# EAGLE schematic Parking Lot System Main Board (EAGLE 9.6.2)
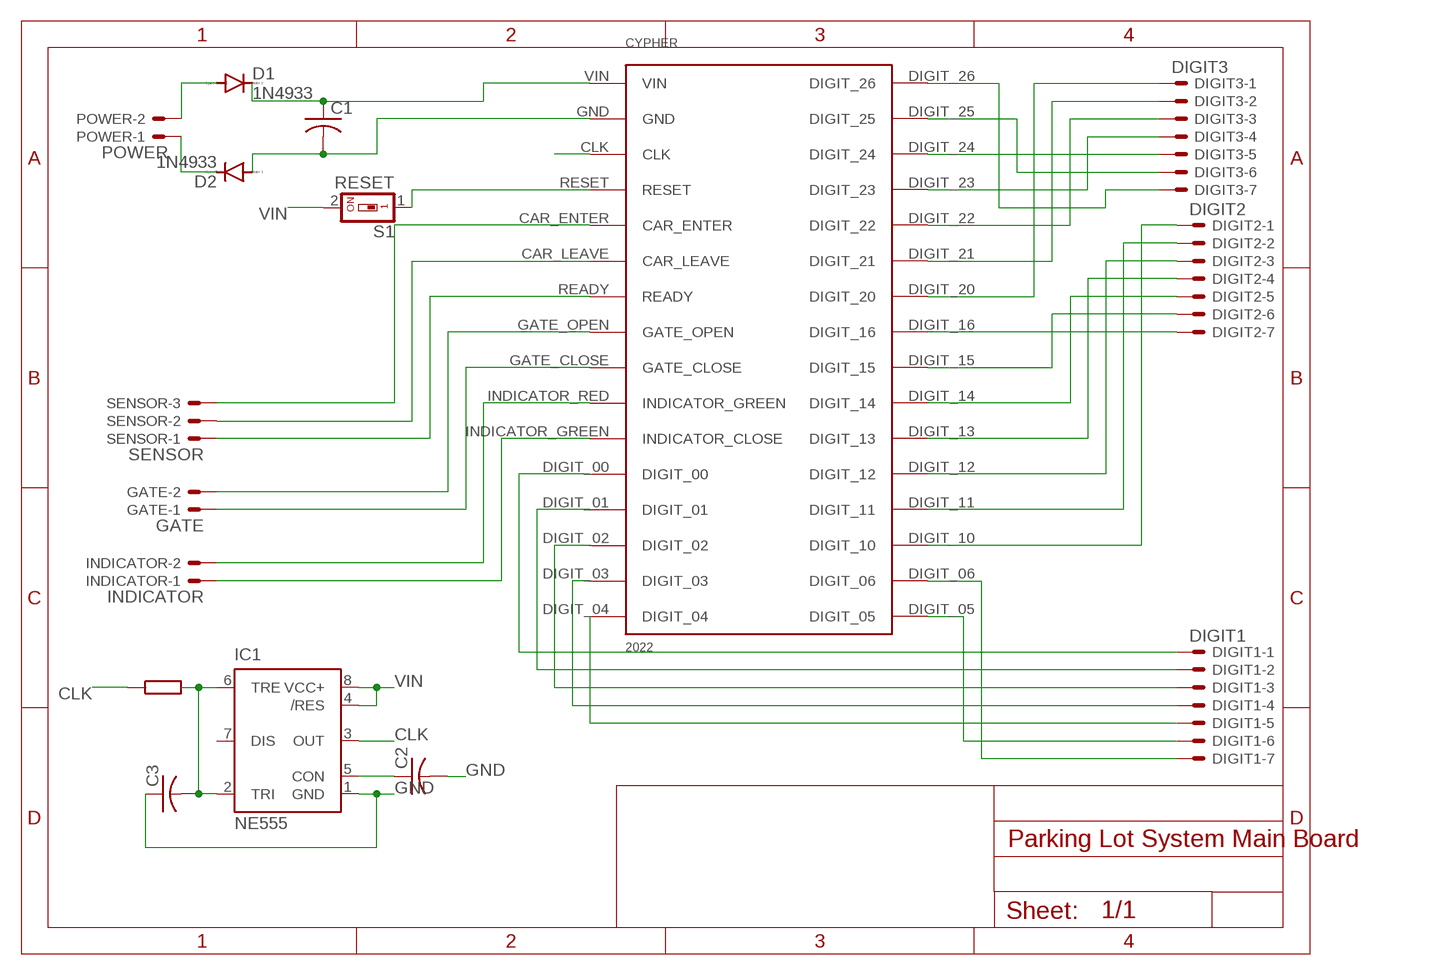
[diagram p0: schematic, sheet 1]

## Parts
C1  C-US050-030X075  [C050-030X075]
C2  C-US050-030X075  [C050-030X075]
C3  C-US050-030X075  [C050-030X075]
CYPHER  CYPHER2022  [CYPHER]
D1  1N4933  [DO41-10]
D2  1N4933  [DO41-10]
DIGIT1  DIGIT1  22-23-2071  [22-23-2071]
DIGIT2  DIGIT2  22-23-2071  [22-23-2071]
DIGIT3  DIGIT3  22-23-2071  [22-23-2071]
GATE  GATE  22-23-2021  [22-23-2021]
IC1  NE555  [DIL-08]
INDICATOR  INDICATOR  22-23-2021  [22-23-2021]
POWER  POWER  22-23-2021  [22-23-2021]
S1  RESET  SWS001  [SMS-001]
SENSOR  SENSOR  22-23-2031  [22-23-2031]

## Nets
CLK: CYPHER.CLK IC1.3(OUT)
GND: C1.2 C2.2 C3.1 CYPHER.GND D2.A IC1.1(GND)
N$1: CYPHER.CAR_ENTER SENSOR.3
N$2: CYPHER.RESET S1.1
N$3: D2.C POWER.1
N$4: D1.A POWER.2
N$5: CYPHER.CAR_LEAVE SENSOR.2
N$6: CYPHER.READY SENSOR.1
N$7: C3.2 IC1.2(TRI) IC1.6(TRE)
N$8: CYPHER.GATE_OPEN GATE.2
N$9: CYPHER.GATE_CLOSE GATE.1
N$10: CYPHER.INDICATOR_RED(INDICATOR_GREEN) INDICATOR.2
N$11: C2.1 IC1.5(CON)
N$12: CYPHER.INDICATOR_GREEN(INDICATOR_CLOSE) INDICATOR.1
N$13: CYPHER.DIGIT_00 DIGIT1.1
N$14: CYPHER.DIGIT_01 DIGIT1.2
N$15: CYPHER.DIGIT_02 DIGIT1.3
N$16: CYPHER.DIGIT_03 DIGIT1.4
N$17: CYPHER.DIGIT_04 DIGIT1.5
N$18: CYPHER.DIGIT_05 DIGIT1.6
N$19: CYPHER.DIGIT_06 DIGIT1.7
N$20: CYPHER.DIGIT_10 DIGIT2.1
N$21: CYPHER.DIGIT_11 DIGIT2.2
N$22: CYPHER.DIGIT_12 DIGIT2.3
N$23: CYPHER.DIGIT_13 DIGIT2.4
N$24: CYPHER.DIGIT_14 DIGIT2.5
N$25: CYPHER.DIGIT_15 DIGIT2.6
N$26: CYPHER.DIGIT_26 DIGIT3.7
N$27: CYPHER.DIGIT_16 DIGIT2.7
N$28: CYPHER.DIGIT_20 DIGIT3.1
N$29: CYPHER.DIGIT_21 DIGIT3.2
N$30: CYPHER.DIGIT_22 DIGIT3.3
N$31: CYPHER.DIGIT_23 DIGIT3.4
N$32: CYPHER.DIGIT_24 DIGIT3.5
N$33: CYPHER.DIGIT_25 DIGIT3.6
VIN: C1.1 CYPHER.VIN D1.C IC1.4(/RES) IC1.8(VCC+) S1.2
Unconnected: IC1.7(DIS)

## Library data of the parts
C1-C3 = rcl:C-US: CAPACITOR, American symbol; SPICEPREFIX: C
CYPHER = CYPHER:CYPHER2022
D1 D2 = diode:1N4933: DIODE fast recovery rectifier, 1A
DIGIT1-DIGIT3 = con-molex:22-23-2071: .100" (2.54mm) Center Header - 7 Pin; MF: MOLEX; MPN: 22-23-2071; OC_FARNELL: 1654534; OC_NEWARK: 56H0445
GATE INDICATOR POWER = con-molex:22-23-2021: .100" (2.54mm) Center Header - 2 Pin; MF: MOLEX; MPN: 22-23-2021; OC_FARNELL: 1462926; OC_NEWARK: 25C3832
IC1 = st-microelectronics:NE555: General purpose bipolar Timer; MF: Arrow Electronics; MPN: NE555N; OC_FARNELL: 1467742; OC_NEWARK: 89K1486
S1 = smd-special:SWS001: SMD Dip Switch 1 pol.
SENSOR = con-molex:22-23-2031: .100" (2.54mm) Center Header - 3 Pin; MF: MOLEX; MPN: 22-23-2031; OC_FARNELL: 1462950; OC_NEWARK: 30C0862